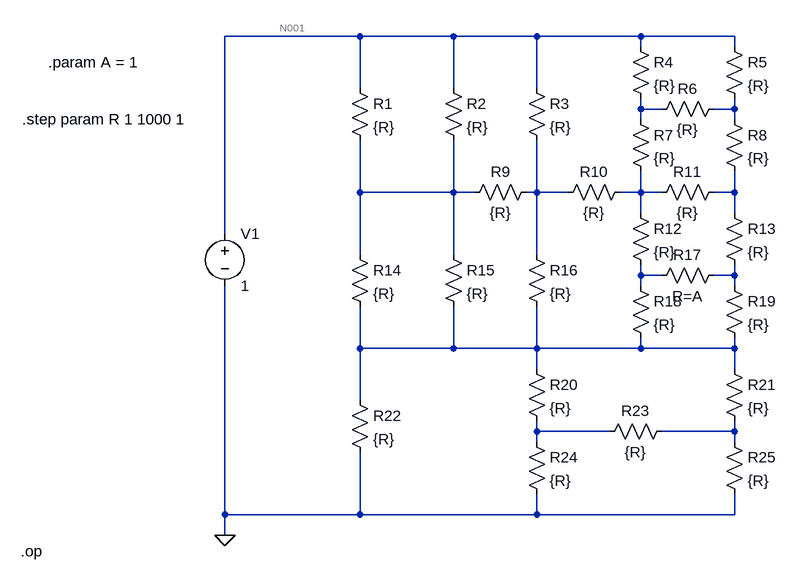
[diagram p0: schematic Aufgabe2.asc]
Aufgabe2.asc, the LTspice schematic file:
Version 4
SHEET 1 880 928
WIRE 224 32 16 32
WIRE 368 32 224 32
WIRE 496 32 368 32
WIRE 656 32 496 32
WIRE 800 32 656 32
WIRE 656 48 656 32
WIRE 800 48 800 32
WIRE 224 112 224 32
WIRE 368 112 368 32
WIRE 496 112 496 32
WIRE 656 144 656 128
WIRE 688 144 656 144
WIRE 800 144 800 128
WIRE 800 144 768 144
WIRE 656 160 656 144
WIRE 800 160 800 144
WIRE 224 272 224 192
WIRE 368 272 368 192
WIRE 368 272 224 272
WIRE 400 272 368 272
WIRE 496 272 496 192
WIRE 496 272 480 272
WIRE 544 272 496 272
WIRE 656 272 656 240
WIRE 656 272 624 272
WIRE 688 272 656 272
WIRE 800 272 800 240
WIRE 800 272 768 272
WIRE 656 304 656 272
WIRE 800 304 800 272
WIRE 16 336 16 32
WIRE 224 368 224 272
WIRE 368 368 368 272
WIRE 496 368 496 272
WIRE 656 400 656 384
WIRE 688 400 656 400
WIRE 800 400 800 384
WIRE 800 400 768 400
WIRE 656 416 656 400
WIRE 800 416 800 400
WIRE 224 512 224 448
WIRE 368 512 368 448
WIRE 368 512 224 512
WIRE 496 512 496 448
WIRE 496 512 368 512
WIRE 656 512 656 496
WIRE 656 512 496 512
WIRE 800 512 800 496
WIRE 800 512 656 512
WIRE 496 544 496 512
WIRE 800 544 800 512
WIRE 224 592 224 512
WIRE 496 640 496 624
WIRE 608 640 496 640
WIRE 800 640 800 624
WIRE 800 640 688 640
WIRE 496 656 496 640
WIRE 800 656 800 640
WIRE 16 768 16 416
WIRE 224 768 224 672
WIRE 224 768 16 768
WIRE 496 768 496 736
WIRE 496 768 224 768
WIRE 800 768 800 736
WIRE 800 768 496 768
WIRE 16 800 16 768
FLAG 16 800 0
SYMBOL voltage 16 320 R0
WINDOW 123 0 0 Left 0
WINDOW 39 0 0 Left 0
SYMATTR InstName V1
SYMATTR Value 1
SYMBOL res 352 96 R0
SYMATTR InstName R2
SYMATTR Value {R}
SYMBOL res 496 256 R90
WINDOW 0 0 56 VBottom 2
WINDOW 3 32 56 VTop 2
SYMATTR InstName R9
SYMATTR Value {R}
SYMBOL res 640 256 R90
WINDOW 0 0 56 VBottom 2
WINDOW 3 32 56 VTop 2
SYMATTR InstName R10
SYMATTR Value {R}
SYMBOL res 784 256 R90
WINDOW 0 0 56 VBottom 2
WINDOW 3 32 56 VTop 2
SYMATTR InstName R11
SYMATTR Value {R}
SYMBOL res 640 32 R0
SYMATTR InstName R4
SYMATTR Value {R}
SYMBOL res 784 32 R0
SYMATTR InstName R5
SYMATTR Value {R}
SYMBOL res 640 144 R0
SYMATTR InstName R7
SYMATTR Value {R}
SYMBOL res 784 144 R0
SYMATTR InstName R8
SYMATTR Value {R}
SYMBOL res 784 128 R90
WINDOW 0 0 56 VBottom 2
WINDOW 3 32 56 VTop 2
SYMATTR InstName R6
SYMATTR Value {R}
SYMBOL res 784 288 R0
SYMATTR InstName R13
SYMATTR Value {R}
SYMBOL res 640 400 R0
SYMATTR InstName R18
SYMATTR Value {R}
SYMBOL res 784 400 R0
SYMATTR InstName R19
SYMATTR Value {R}
SYMBOL res 784 384 R90
WINDOW 0 0 56 VBottom 2
WINDOW 3 32 56 VTop 2
SYMATTR InstName R17
SYMATTR Value R=A
SYMBOL res 208 96 R0
SYMATTR InstName R1
SYMATTR Value {R}
SYMBOL res 480 96 R0
SYMATTR InstName R3
SYMATTR Value {R}
SYMBOL res 208 352 R0
SYMATTR InstName R14
SYMATTR Value {R}
SYMBOL res 352 352 R0
SYMATTR InstName R15
SYMATTR Value {R}
SYMBOL res 480 352 R0
SYMATTR InstName R16
SYMATTR Value {R}
SYMBOL res 480 528 R0
SYMATTR InstName R20
SYMATTR Value {R}
SYMBOL res 480 640 R0
SYMATTR InstName R24
SYMATTR Value {R}
SYMBOL res 784 528 R0
SYMATTR InstName R21
SYMATTR Value {R}
SYMBOL res 784 640 R0
SYMATTR InstName R25
SYMATTR Value {R}
SYMBOL res 704 624 R90
WINDOW 0 0 56 VBottom 2
WINDOW 3 32 56 VTop 2
SYMATTR InstName R23
SYMATTR Value {R}
SYMBOL res 208 576 R0
SYMATTR InstName R22
SYMATTR Value {R}
SYMBOL res 640 288 R0
SYMATTR InstName R12
SYMATTR Value {R}
TEXT -256 72 Left 2 !.param A = 1
TEXT -296 160 Left 2 !.step param R 1 1000 1
TEXT -298 824 Left 2 !.op

The netlist it stands for:
* Aufgabe2.asc
V1 N001 0 1
R2 N001 N004 {R}
R9 N005 N004 {R}
R10 N006 N005 {R}
R11 N007 N006 {R}
R4 N001 N002 {R}
R5 N001 N003 {R}
R7 N002 N006 {R}
R8 N003 N007 {R}
R6 N003 N002 {R}
R13 N007 N009 {R}
R18 N008 N010 {R}
R19 N009 N010 {R}
R17 N009 N008 R=A
R1 N001 N004 {R}
R3 N001 N005 {R}
R14 N004 N010 {R}
R15 N004 N010 {R}
R16 N005 N010 {R}
R20 N010 N011 {R}
R24 N011 0 {R}
R21 N010 N012 {R}
R25 N012 0 {R}
R23 N012 N011 {R}
R22 N010 0 {R}
R12 N006 N008 {R}
.param A = 1
.step param R 1 1000 1
.op
.backanno
.end

* Results of the author's LTspice run, read from the files saved beside the schematic
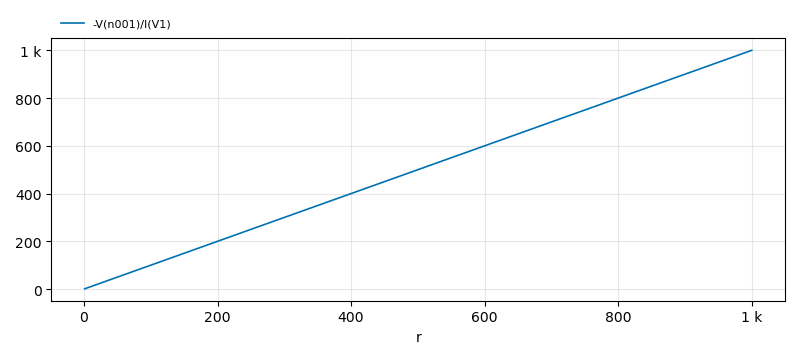
[diagram p1: Operating Point of Aufgabe2.asc, plotted from the saved traces]
* Operating Point, 1 run:
*   -V(n001)/I(V1): 1  at r=1 , 1 k at r=1 k, min 1 , max 1 k